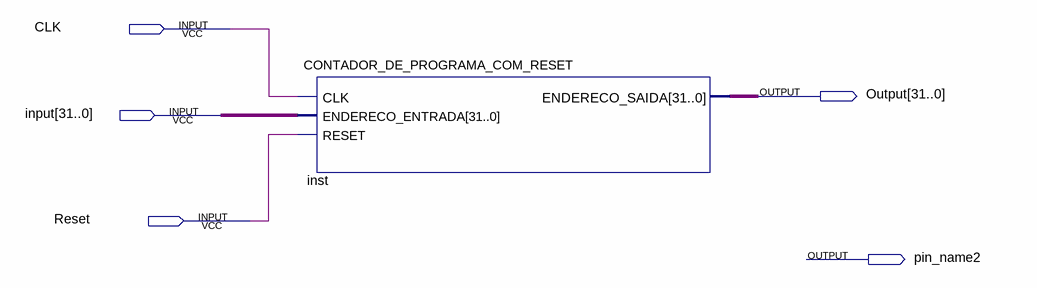
[diagram p0: schematic sheet]
// Quartus schematic teste_componentes.bdf as structural Verilog: 1 symbols, 5 pins
module teste_componentes (
  input  CLK,
  input  [31:0] \input ,
  input  Reset,
  output [31:0] Output,
  output pin_name2
);

  CONTADOR_DE_PROGRAMA_COM_RESET inst (.CLK(CLK), .ENDERECO_ENTRADA(\input ), .RESET(Reset), .ENDERECO_SAIDA(Output));
endmodule
